# EAGLE design dwarfid (EAGLE 8.3.2)
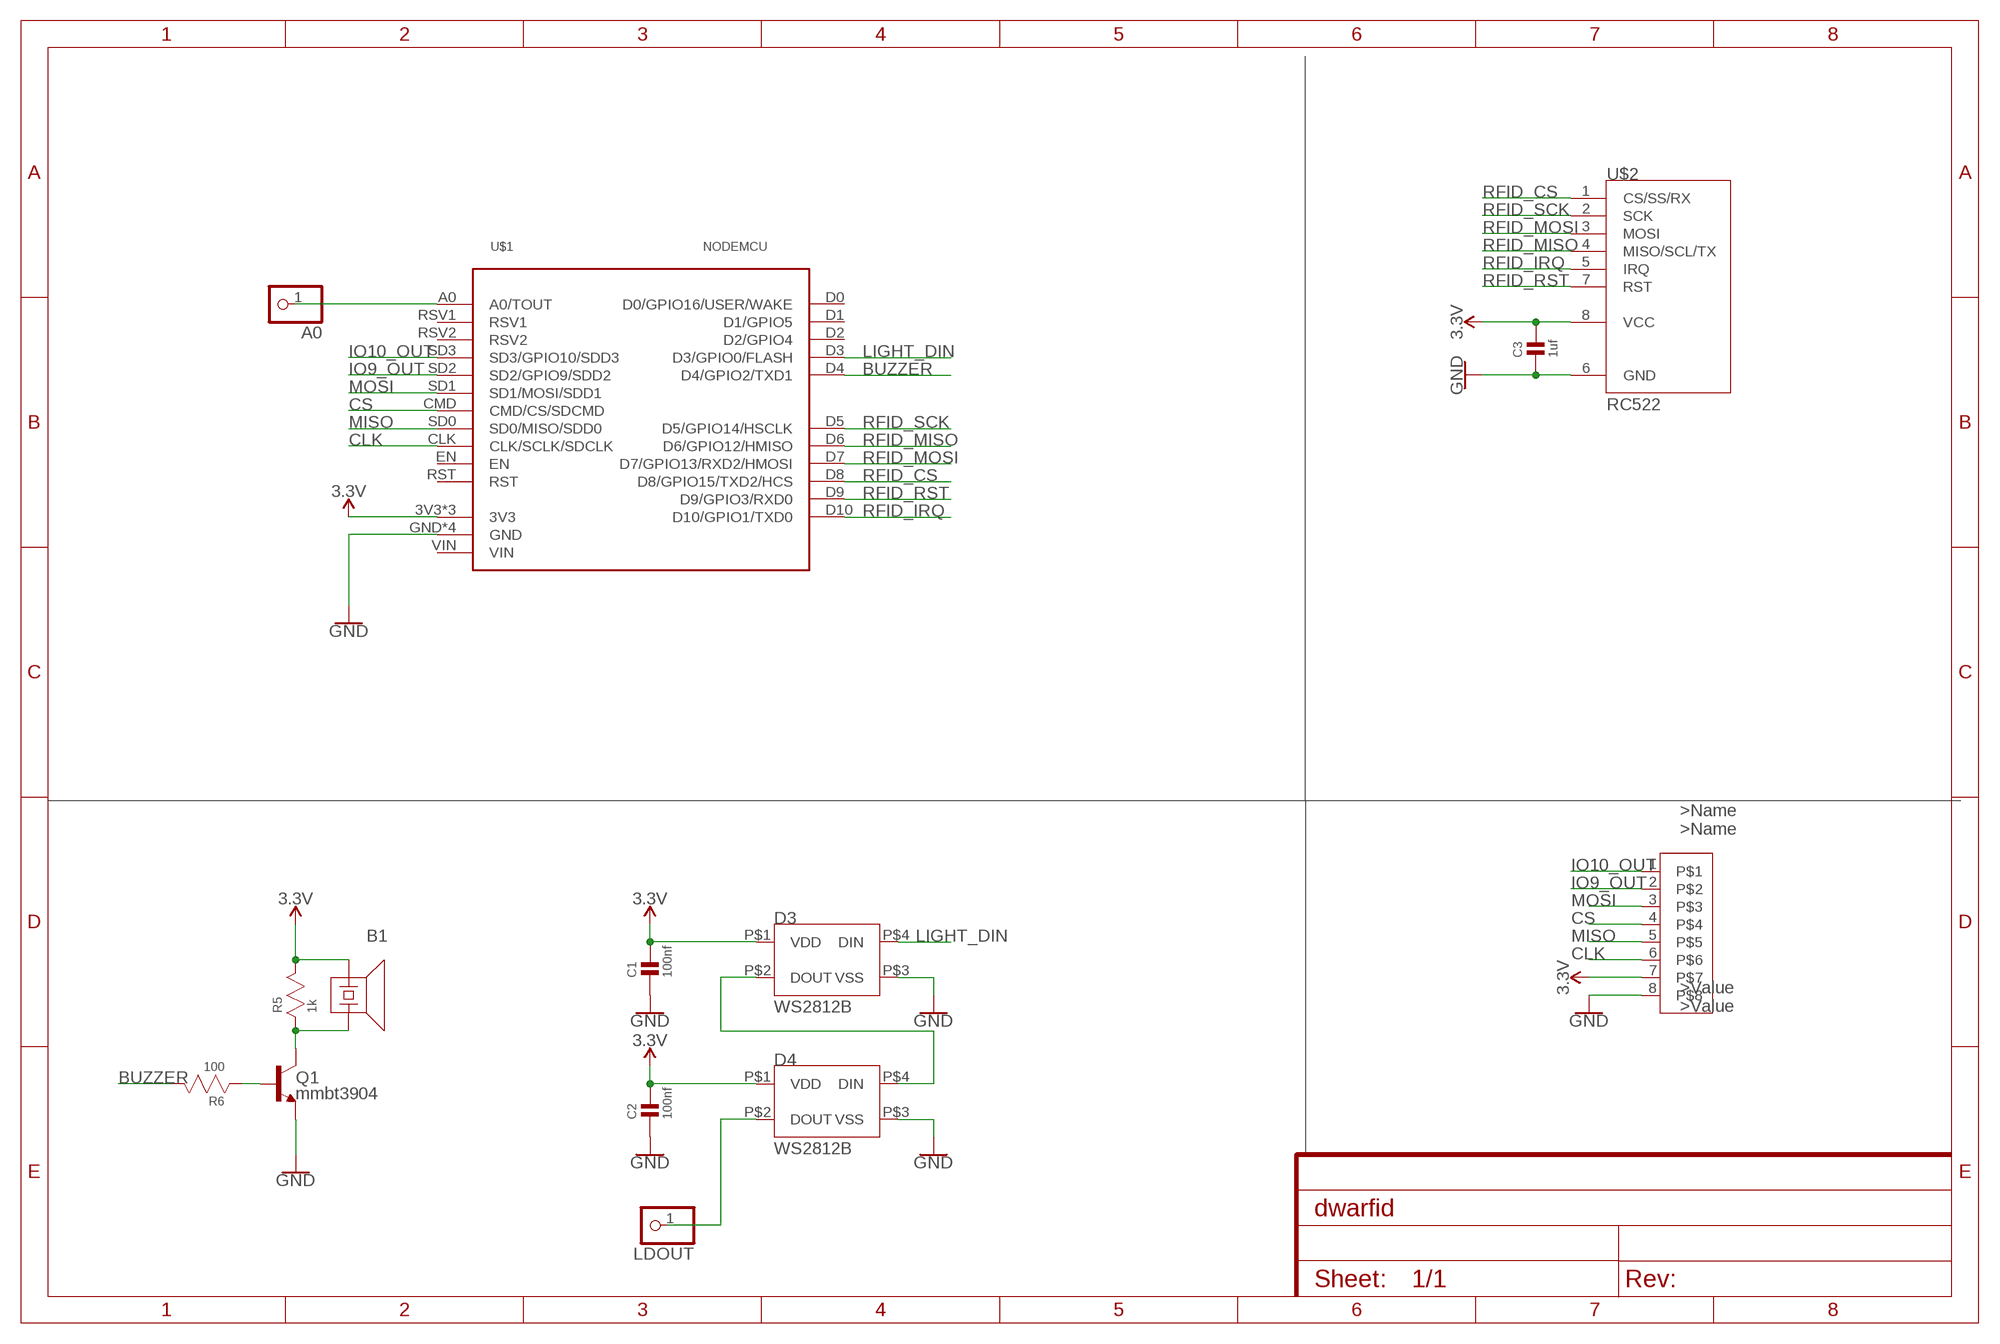
[diagram p0: schematic, sheet 1]

## Parts
A0  PINHD-1X1  [1X01]
B1  PS1720P02_PIEZO_BUZZER  [PS1720P02_PIEZO]
C1  100nf  CAP_0603  [PASSIVE_0603]
C2  100nf  CAP_0603  [PASSIVE_0603]
C3  1uf  CAP_0603  [PASSIVE_0603]
D3  WS2812B  [WS2812B]
D4  WS2812B  [WS2812B]
LDOUT  PINHD-1X1  [1X01]
Q1  mmbt3904  TRANS_NPN-MMBT2222AL  [SOT23-3]
R5  1k  RES_0603  [PASSIVE_0603]
R6  100  RES_0603  [PASSIVE_0603]
U$1  NODEMCU  [NODEMCU]
U$2  RC522  [RC522]
U$3  JST8_2MM_RIGHTANGLE  [JST_2MM_8POS]

## Nets
3.3V: B1.P$1 C1.P$2 C2.P$2 C3.P$2 D3.P$1(VDD) D4.P$1(VDD) R5.P$2 U$1.3V3 U$1.3V3_2(3V3) U$1.3V3_3(3V3) U$2.8(VCC) U$3.7
BUZZER: R6.P$2 U$1.D4(D4/GPIO2/TXD1)
CLK: U$1.CLK(CLK/SCLK/SDCLK) U$3.6
CS: U$1.CMD(CMD/CS/SDCMD) U$3.4
GND: C1.P$1 C2.P$1 C3.P$1 D3.P$3(VSS) D4.P$3(VSS) Q1.2(E) U$1.GND U$1.GND2(GND) U$1.GND3(GND) U$1.GND4(GND) U$2.6(GND) U$3.8
IO9_OUT: U$1.SD2(SD2/GPIO9/SDD2) U$3.2
IO10_OUT: U$1.SD3(SD3/GPIO10/SDD3) U$3.1
LIGHT_DIN: D3.P$4(DIN) U$1.D3(D3/GPIO0/FLASH)
MISO: U$1.SD0(SD0/MISO/SDD0) U$3.5
MOSI: U$1.SD1(SD1/MOSI/SDD1) U$3.3
N$2: D4.P$2(DOUT) LDOUT.1
N$6: B1.P$2 Q1.3(C) R5.P$1
N$7: D3.P$2(DOUT) D4.P$4(DIN)
N$8: A0.1 U$1.A0(A0/TOUT)
N$9: Q1.1(B) R6.P$1
RFID_CS: U$1.D8(D8/GPIO15/TXD2/HCS) U$2.1(CS/SS/RX)
RFID_IRQ: U$1.D10(D10/GPIO1/TXD0) U$2.5(IRQ)
RFID_MISO: U$1.D6(D6/GPIO12/HMISO) U$2.4(MISO/SCL/TX)
RFID_MOSI: U$1.D7(D7/GPIO13/RXD2/HMOSI) U$2.3(MOSI)
RFID_RST: U$1.D9(D9/GPIO3/RXD0) U$2.7(RST)
RFID_SCK: U$1.D5(D5/GPIO14/HSCLK) U$2.2(SCK)
Unconnected: U$1.D0(D0/GPIO16/USER/WAKE) U$1.D1(D1/GPIO5) U$1.D2(D2/GPIO4) U$1.EN U$1.RST U$1.RSV1 U$1.RSV2 U$1.VIN

## Library data of the parts
A0 LDOUT = adafruit:PINHD-1X1: Pin header 1x1 for 0.1" spacing With round pins
B1 = rowe_actuators:PS1720P02_PIEZO_BUZZER
C1-C3 = rowe_passives:CAP_0603
D3 D4 = rowe_actuators:WS2812B
Q1 = SparkFun-DiscreteSemi:TRANS_NPN: NPN transistor Current controlled devices typically used to amplify current or used as a switch. BC547 - COM-08928 <http://www.sparkfun.com/products/8928> (TO-92 45V 100mA) (1.Collector 2.Base 3.Emitter) 2N3904 - COM-00521 <http://www.sparkfun.com/products/521> (TO-92 40V 200mA) (1.Emitter 2.Base 3.Collector) P2N2222A - COM-12852 <http://www.sparkfun.com/products/12852> (TO-92 40V 600mA) (1.Collector 2.Base 3.Emitter); PROD_ID: TRANS-08049; VALUE: 600mA/40V
R5 R6 = rowe_passives:RES_0603
U$1 = controller_boards:NODEMCU
U$2 = controller_boards:RC522
U$3 = rowe_connectors:JST8_2MM_RIGHTANGLE

## Board
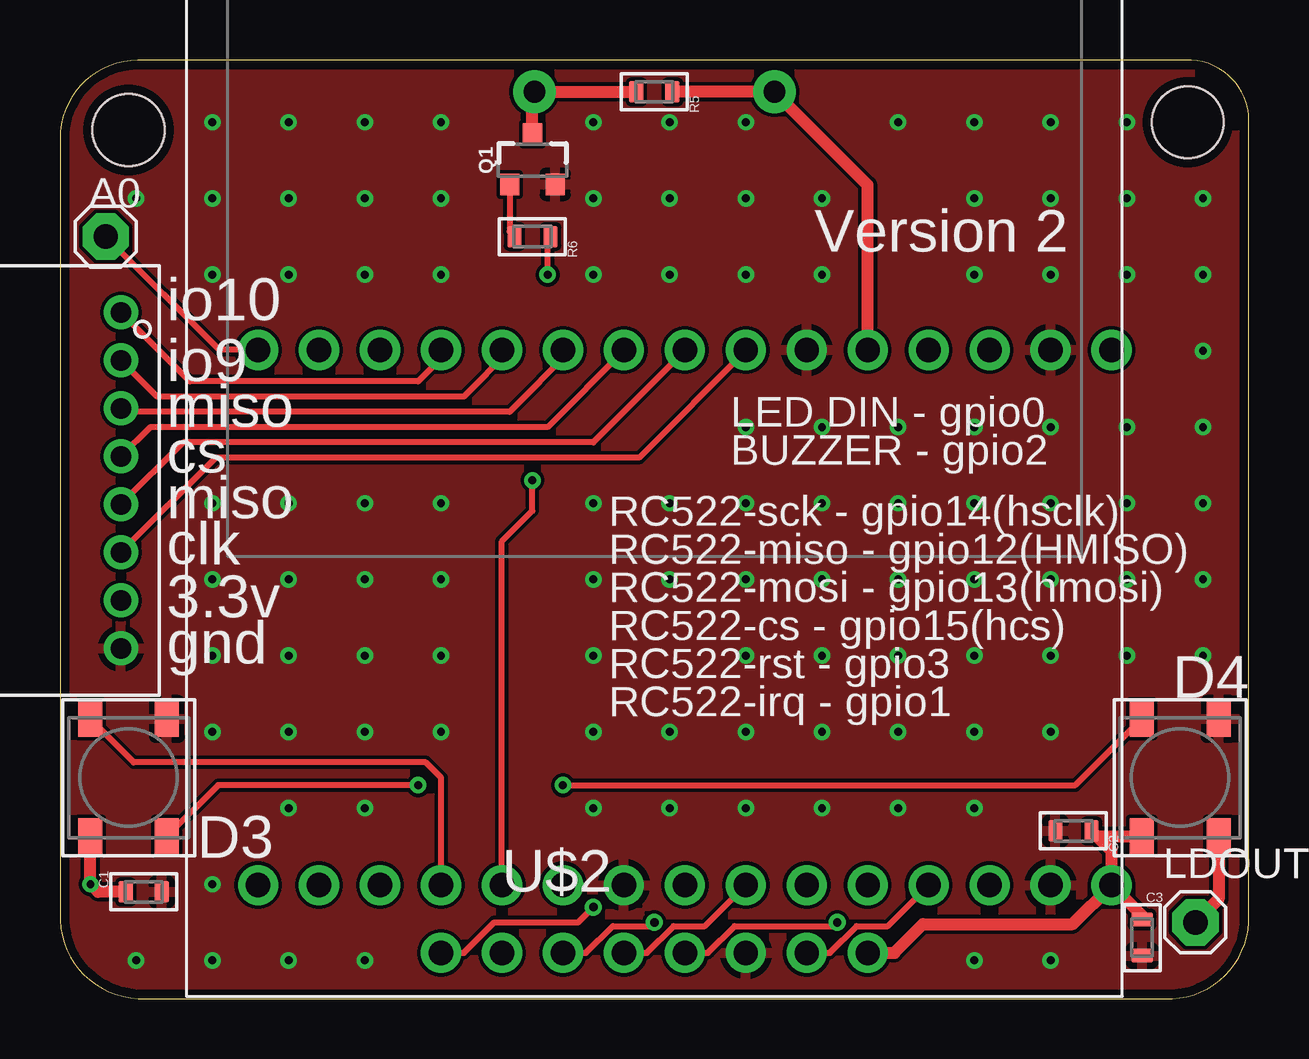
[diagram p1: board, top side]
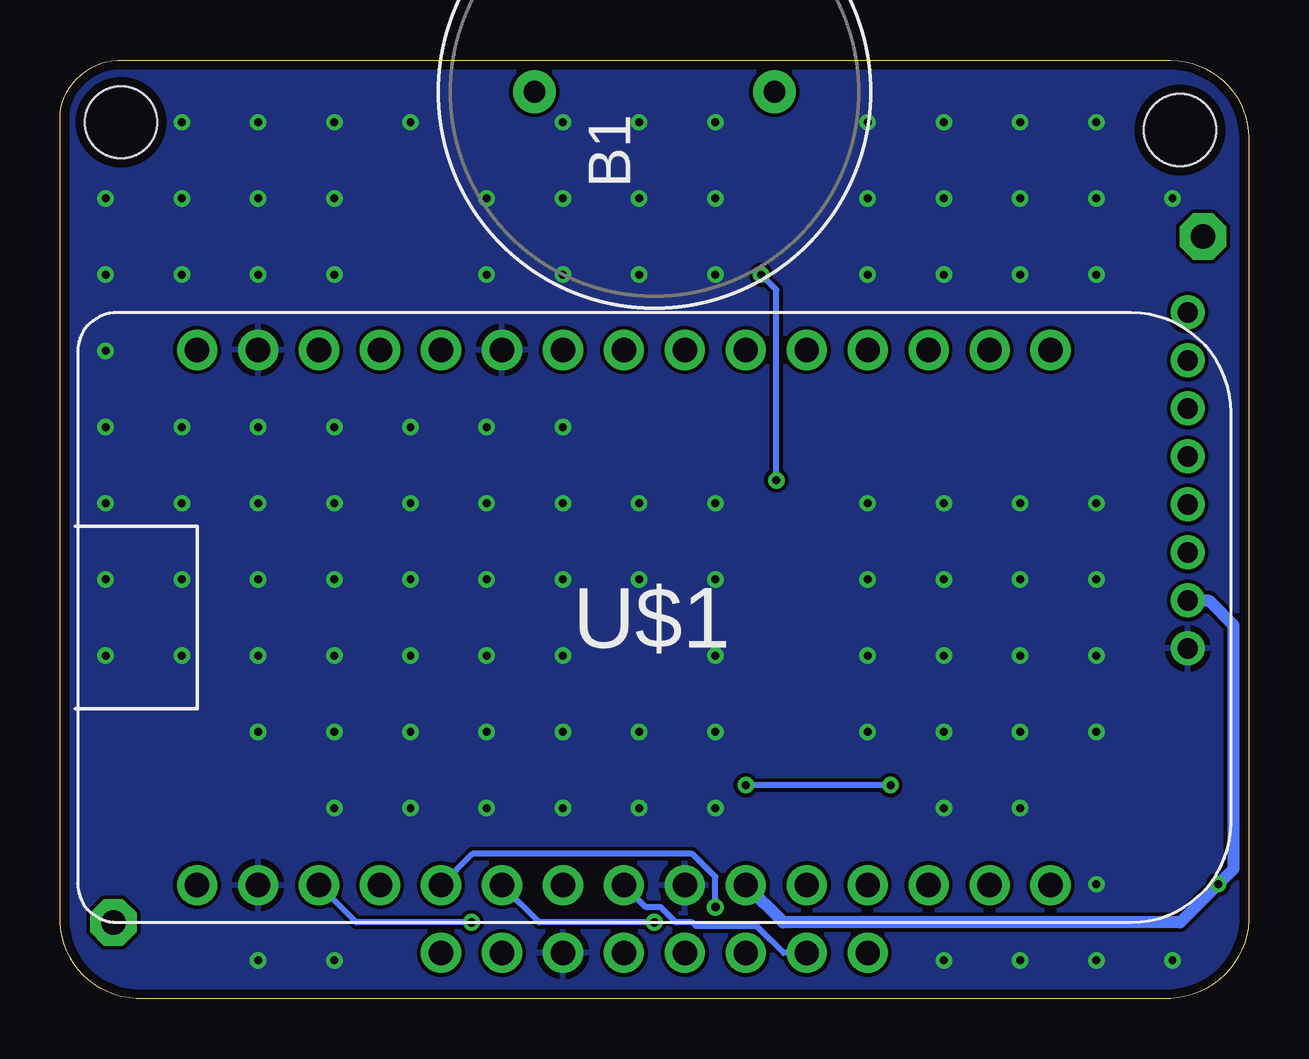
[diagram p2: board, bottom side, seen from below]

Size 49.53 x 39.11 mm. Coordinates in mm from the lower left corner, seen from the top.
Outline: 0,35.84 0,3.25 arc90 3.57,0 46.04,0 arc90 49.53,3.18 49.53,36.86 arc90 46.67,39.09 3.25,39.09 arc90 0,35.84
Copper layers (1*16): Top 0.0356mm / dielectric 1.5011mm / Bottom 0.0356mm
Design rules "oshpark-2layer": minimum track width 6mil, minimum drill 13mil, track to track 6mil, track to pad 6mil, pad to pad 6mil, via to via 6mil, smd to smd 6mil, copper to edge 15mil, drill to drill 6mil, minimum pad ring 7mil, minimum via ring 7mil, stop-mask expansion 2.5mil, vias tented up to drill 0mil, thermal gap 10mil
Holes 3 mm at 2.86,36.2 46.99,36.51

### Footprints (pad centres in the part's own frame; a part is rotated, then mirrored left to right if it is on the bottom)
1X01 = drill 1.016 pad 1.93 octagon: 1 0,0
PS1720P02_PIEZO = drill 0.9 pad 1.778: P$1 0,5; P$2 0,-5
PASSIVE_0603 = smd 0.6 x 0.9: P$1 -0.75,0; P$2 0.75,0
WS2812B = smd 1.5 x 1: P$1 -2.45,1.6; P$2 -2.45,-1.6; P$3 2.45,-1.6; P$4 2.45,1.6
SOT23-3 = smd 0.8 x 0.9: 1 -0.95,-1; 2 0.95,-1; 3 0,1.1
NODEMCU = drill 1.016 pad 1.676: 3V3 -11.15,-8.89; 3V3_2 11.15,-19.05; 3V3_3 11.15,3.81; A0 -11.15,16.51; CLK -11.15,-3.81; CMD -11.15,1.27; D0 11.15,16.51; D1 11.15,13.97; D2 11.15,11.43; D3 11.15,8.89; D4 11.15,6.35; D5 11.15,-1.27; D6 11.15,-3.81; D7 11.15,-6.35; D8 11.15,-8.89; D9 11.15,-11.43; D10 11.15,-13.97; EN -11.15,-11.43; GND -11.15,-6.35; GND2 -11.15,-16.51; GND3 11.15,-16.51; GND4 11.15,1.27; RST -11.15,-13.97; RSV1 -11.15,13.97; RSV2 -11.15,11.43; SD0 -11.15,-1.27; SD1 -11.15,3.81; SD2 -11.15,6.35; SD3 -11.15,8.89; VIN -11.15,-19.05
RC522 = drill 1.016 pad 1.676: 1 -8.89,-27.94; 2 -6.35,-27.94; 3 -3.81,-27.94; 4 -1.27,-27.94; 5 1.27,-27.94; 6 3.81,-27.94; 7 6.35,-27.94; 8 8.89,-27.94
JST_2MM_8POS = drill 0.85 pad 1.422: 1 0,7; 2 0,5; 3 0,3; 4 0,1; 5 0,-1; 6 0,-3; 7 0,-5; 8 0,-7

### Placement (x,y rotation side)
A0  1.91,31.75 0 top
B1  24.77,37.78 90 bottom
C1  3.49,4.45 180 top
C2  42.23,6.99 0 top
C3  45.09,2.54 90 top
D3  2.86,9.21 90 top
D4  46.67,9.21 90 top
LDOUT  47.31,3.18 0 top
Q1  19.68,34.93 0 top
R5  24.77,37.78 0 top
R6  19.68,31.75 0 top
U$1  24.77,15.88 270 bottom
U$2  24.77,29.85 0 top
U$3  2.54,21.59 0 top

### Tracks (layer width: path | path; a pad name or v marks a point on that pad's centre or on a via)
3.3V  (via drill 0.33)
  Top 0.254: 45.11,6.76 D4.P$1
  Top 0.508: D3.P$1 1.27,6.43 v1.27,4.76 1.59,4.45 C1.P$2 | 43.2,6.76 D4.P$1 | 43.2,6.76 C2.P$2 | U$2.8 34.76,1.91 35.96,3.1 42.19,3.1 U$1.3V3_2 | U$1.3V3 33.66,33.89 B1.P$1 R5.P$2 | C3.P$2 45.09,3.46 U$1.3V3_2 | U$1.3V3_2 43.81,6.15 43.2,6.76
  Bottom 0.508: U$3.7 1.67,16.59 0.64,15.56 0.64,5.4 v1.27,4.76 2.86,3.18 19.41,3.18 U$1.3V3_3
BUZZER  (via drill 0.33)
  Top 0.254: U$1.D4 18.41,19.05 19.68,20.32 v19.68,21.59 | v20.32,30.16 20.32,31.64 R6.P$2
  Bottom 0.254: v19.68,21.59 19.68,29.53 v20.32,30.16
CLK
  Top 0.254: U$1.CLK 28.61,27.03 24.13,22.54 6.49,22.54 U$3.6
CS
  Top 0.254: U$1.CMD 23.53,27.03 20.32,23.81 3.76,23.81 U$3.4
GND  (via drill 0.33)
  other vias: 41.27,36.51 38.1,36.51 34.92,36.51 41.27,33.34 44.45,36.51 44.45,33.34 47.62,33.34 47.62,30.16 44.45,30.16 41.27,30.16 38.1,30.16 38.1,33.34 47.62,26.99 47.62,23.81 44.45,23.81 47.62,20.64 47.62,17.46 47.62,14.29 44.45,14.29 44.45,17.46 44.45,20.64 41.27,23.81 41.27,20.64 41.27,17.46 41.27,14.29 41.27,11.11 38.1,11.11 38.1,14.29 38.1,17.46 38.1,20.64 38.1,23.81 34.92,23.81 34.92,20.64 34.92,17.46 34.92,14.29 34.92,11.11 31.75,11.11 31.75,14.29 31.75,17.46 31.75,20.64 31.75,23.81 28.57,23.81 28.57,20.64 25.4,20.64 22.23,20.64 22.23,17.46 25.4,17.46 28.57,17.46 28.57,14.29 28.57,11.11 25.4,11.11 22.23,11.11 22.23,14.29 15.88,17.46 15.88,14.29 15.88,11.11 12.7,17.46 12.7,14.29 12.7,11.11 15.88,20.64 12.7,20.64 9.53,20.64 9.53,17.46 9.53,14.29 9.53,11.11 6.35,11.11 6.35,14.29 6.35,17.46 6.35,20.64 12.7,7.94 9.53,7.94 6.35,4.76 6.35,1.59 3.17,1.59 9.53,1.59 12.7,1.59 22.23,7.94 25.4,7.94 28.57,7.94 31.75,7.94 34.92,7.94 38.1,7.94 38.1,1.59 41.27,1.59 12.7,36.51 12.7,33.34 12.7,30.16 15.88,30.16 15.88,33.34 25.4,33.34 28.57,33.34 31.75,33.34 31.75,30.16 28.57,30.16 25.4,30.16 22.23,33.34 22.23,30.16 15.88,36.51 9.53,36.51 9.53,33.34 9.53,30.16 6.35,36.51 6.35,33.34 6.35,30.16 3.17,33.34 28.57,36.51 25.4,36.51 22.23,36.51
  pour Top: -1.91,45.09 51.44,45.09 51.44,-0.32 -1.91,-0.32
  pour Bottom: -3.17,46.36 53.34,46.36 53.34,-1.59 -3.17,-1.59
IO9_OUT
  Top 0.254: U$1.SD2 18.77,27.03 16.83,25.08 4.05,25.08 U$3.2
IO10_OUT
  Top 0.254: U$1.SD3 16.23,27.03 14.92,25.72 5.41,25.72 U$3.1
LIGHT_DIN
  Top 0.254: U$1.D3 15.88,9.21 15.24,9.84 3.07,9.84 D3.P$4
MISO
  Top 0.254: U$1.SD0 26.07,27.03 22.23,23.18 5.13,23.18 U$3.5
MOSI
  Top 0.254: U$1.SD1 21.31,27.03 18.73,24.45 2.68,24.45 U$3.3
N$2
  Top 0.508: D4.P$2 48.27,4.14 LDOUT.1
N$6
  Top 0.508: R5.P$1 B1.P$2 19.68,37.7 Q1.3
N$7  (via drill 0.33)
  Top 0.254: 4.46,7 D3.P$2 6.59,8.89 v14.92,8.89 | v20.95,8.89 42.3,8.89 D4.P$4
  Bottom 0.254: v14.92,8.89 v20.95,8.89
N$8
  Top 0.254: U$1.A0 6.63,27.03 A0.1
N$9
  Top 0.254: Q1.1 18.73,31.95 R6.P$1
RFID_CS  (via drill 0.35)
  Top 0.254: U$2.1 16.83,1.91 18.1,3.18 21.59,3.18 v22.23,3.81
  Bottom 0.254: v22.23,3.81 22.23,5.08 23.18,6.03 32.35,6.03 U$1.D8
RFID_IRQ  (via drill 0.35)
  Top 0.254: U$2.5 26.99,1.91 28.11,3.02 32.23,3.02 v32.38,3.18
  Bottom 0.254: v32.38,3.18 37.19,3.18 U$1.D10
RFID_MISO
  Top 0.254: U$2.4 24.45,1.91 25.57,3.02 26.87,3.02 U$1.D6
RFID_MOSI  (via drill 0.35)
  Top 0.254: U$2.3 21.91,1.91 23.03,3.02 24.61,3.02 v24.77,3.18
  Bottom 0.254: v24.77,3.18 29.57,3.18 U$1.D7
RFID_RST
  Top 0.254: U$2.7 32.07,1.91 33.19,3.02 34.49,3.02 U$1.D9
RFID_SCK
  Bottom 0.254: U$2.2 19.37,1.91 20.49,3.02 23.02,3.02 23.18,3.18 23.87,3.18 24.5,3.81 25.12,3.81 U$1.D5

### Text on the board
tPlace: Version 2 | io10 | io9 | miso | LED DIN - gpio0 | cs | BUZZER - gpio2 | miso | RC522-sck - gpio14(hsclk) | clk | RC522-miso - gpio12(HMISO) | RC522-mosi - gpio13(hmosi) | 3.3v | RC522-cs - gpio15(hcs) | gnd | RC522-rst - gpio3 | RC522-irq - gpio1